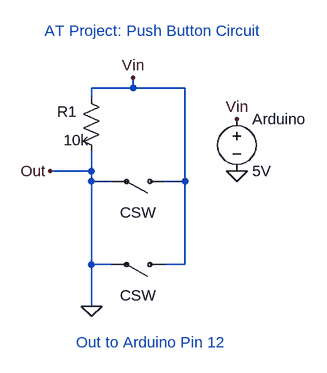
[diagram p0: schematic button_switch.asc]
button_switch.asc, the LTspice schematic file:
Version 4
SHEET 1 880 680
WIRE 208 -64 208 -80
WIRE 208 -64 144 -64
WIRE 288 -64 208 -64
WIRE 144 -48 144 -64
WIRE 144 64 144 32
WIRE 144 64 80 64
WIRE 144 80 144 64
WIRE 176 80 144 80
WIRE 288 80 288 -64
WIRE 288 80 256 80
WIRE 144 208 144 80
WIRE 176 208 144 208
WIRE 288 208 288 80
WIRE 288 208 256 208
WIRE 144 272 144 208
FLAG 368 64 0
FLAG 368 -16 Vin
FLAG 208 -80 Vin
FLAG 80 64 Out
FLAG 144 272 0
SYMBOL csw 256 208 R90
WINDOW 0 -32 40 VBottom 2
WINDOW 3 32 40 VTop 2
SYMBOL csw 256 80 R90
WINDOW 0 -32 40 VBottom 2
WINDOW 3 32 40 VTop 2
SYMBOL voltage 368 -32 R0
SYMATTR InstName Arduino
SYMATTR Value 5V
SYMBOL res 128 -64 R0
WINDOW 0 -37 36 Left 2
WINDOW 3 -27 80 Left 2
SYMATTR InstName R1
SYMATTR Value 10k
TEXT 72 -152 Left 2 ;AT Project: Push Button Circuit
TEXT 120 328 Left 2 ;Out to Arduino Pin 12

The netlist it stands for:
* button_switch.asc
W§? Vin 0 CSW
W§? Vin 0 CSW
V§Arduino Vin 0 5V
R1 Vin 0 10k
* AT Project: Push Button Circuit
* Out to Arduino Pin 12
.backanno
.end